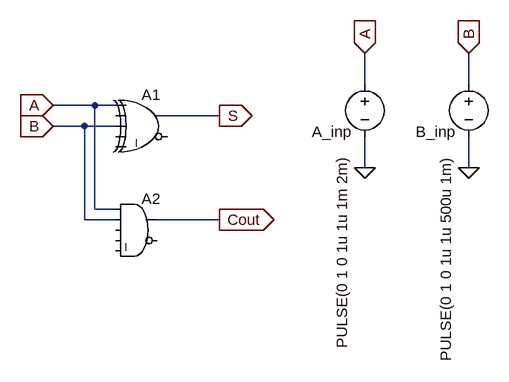
[diagram p0: schematic HalfAdder.asc]
HalfAdder.asc, the LTspice schematic file:
Version 4
SHEET 1 880 708
WIRE 528 32 528 -16
WIRE 688 32 688 -16
WIRE 112 64 48 64
WIRE 144 64 112 64
WIRE 304 80 208 80
WIRE 96 96 48 96
WIRE 144 96 96 96
WIRE 528 160 528 112
WIRE 688 160 688 112
WIRE 112 224 112 64
WIRE 144 224 112 224
WIRE 96 240 96 96
WIRE 144 240 96 240
WIRE 304 240 208 240
FLAG 48 64 A
IOPIN 48 64 In
FLAG 48 96 B
IOPIN 48 96 In
FLAG 304 80 S
IOPIN 304 80 Out
FLAG 304 240 Cout
IOPIN 304 240 Out
FLAG 528 160 0
FLAG 528 -16 A
IOPIN 528 -16 In
FLAG 688 160 0
FLAG 688 -16 B
IOPIN 688 -16 In
SYMBOL Digital\\xor 192 32 R0
SYMATTR InstName A1
SYMBOL Digital\\and 176 192 R0
SYMATTR InstName A2
SYMBOL voltage 528 16 R0
WINDOW 0 -82 89 Left 2
WINDOW 3 -35 125 VRight 2
WINDOW 123 0 0 Left 0
WINDOW 39 0 0 Left 0
SYMATTR InstName A_inp
SYMATTR Value PULSE(0 1 0 1u 1u 1m 2m)
SYMBOL voltage 688 16 R0
WINDOW 0 -82 89 Left 2
WINDOW 3 -35 125 VRight 2
WINDOW 123 0 0 Left 0
WINDOW 39 0 0 Left 0
SYMATTR InstName B_inp
SYMATTR Value PULSE(0 1 0 1u 1u 500u 1m)

The netlist it stands for:
* HalfAdder.asc
A1 A 0 B 0 0 0 S 0 XOR
A2 A B 0 0 0 0 Cout 0 AND
V§A_inp A 0 PULSE(0 1 0 1u 1u 1m 2m)
V§B_inp B 0 PULSE(0 1 0 1u 1u 500u 1m)
.backanno
.end